# EAGLE schematic SipNPuff (EAGLE 9.7.0)
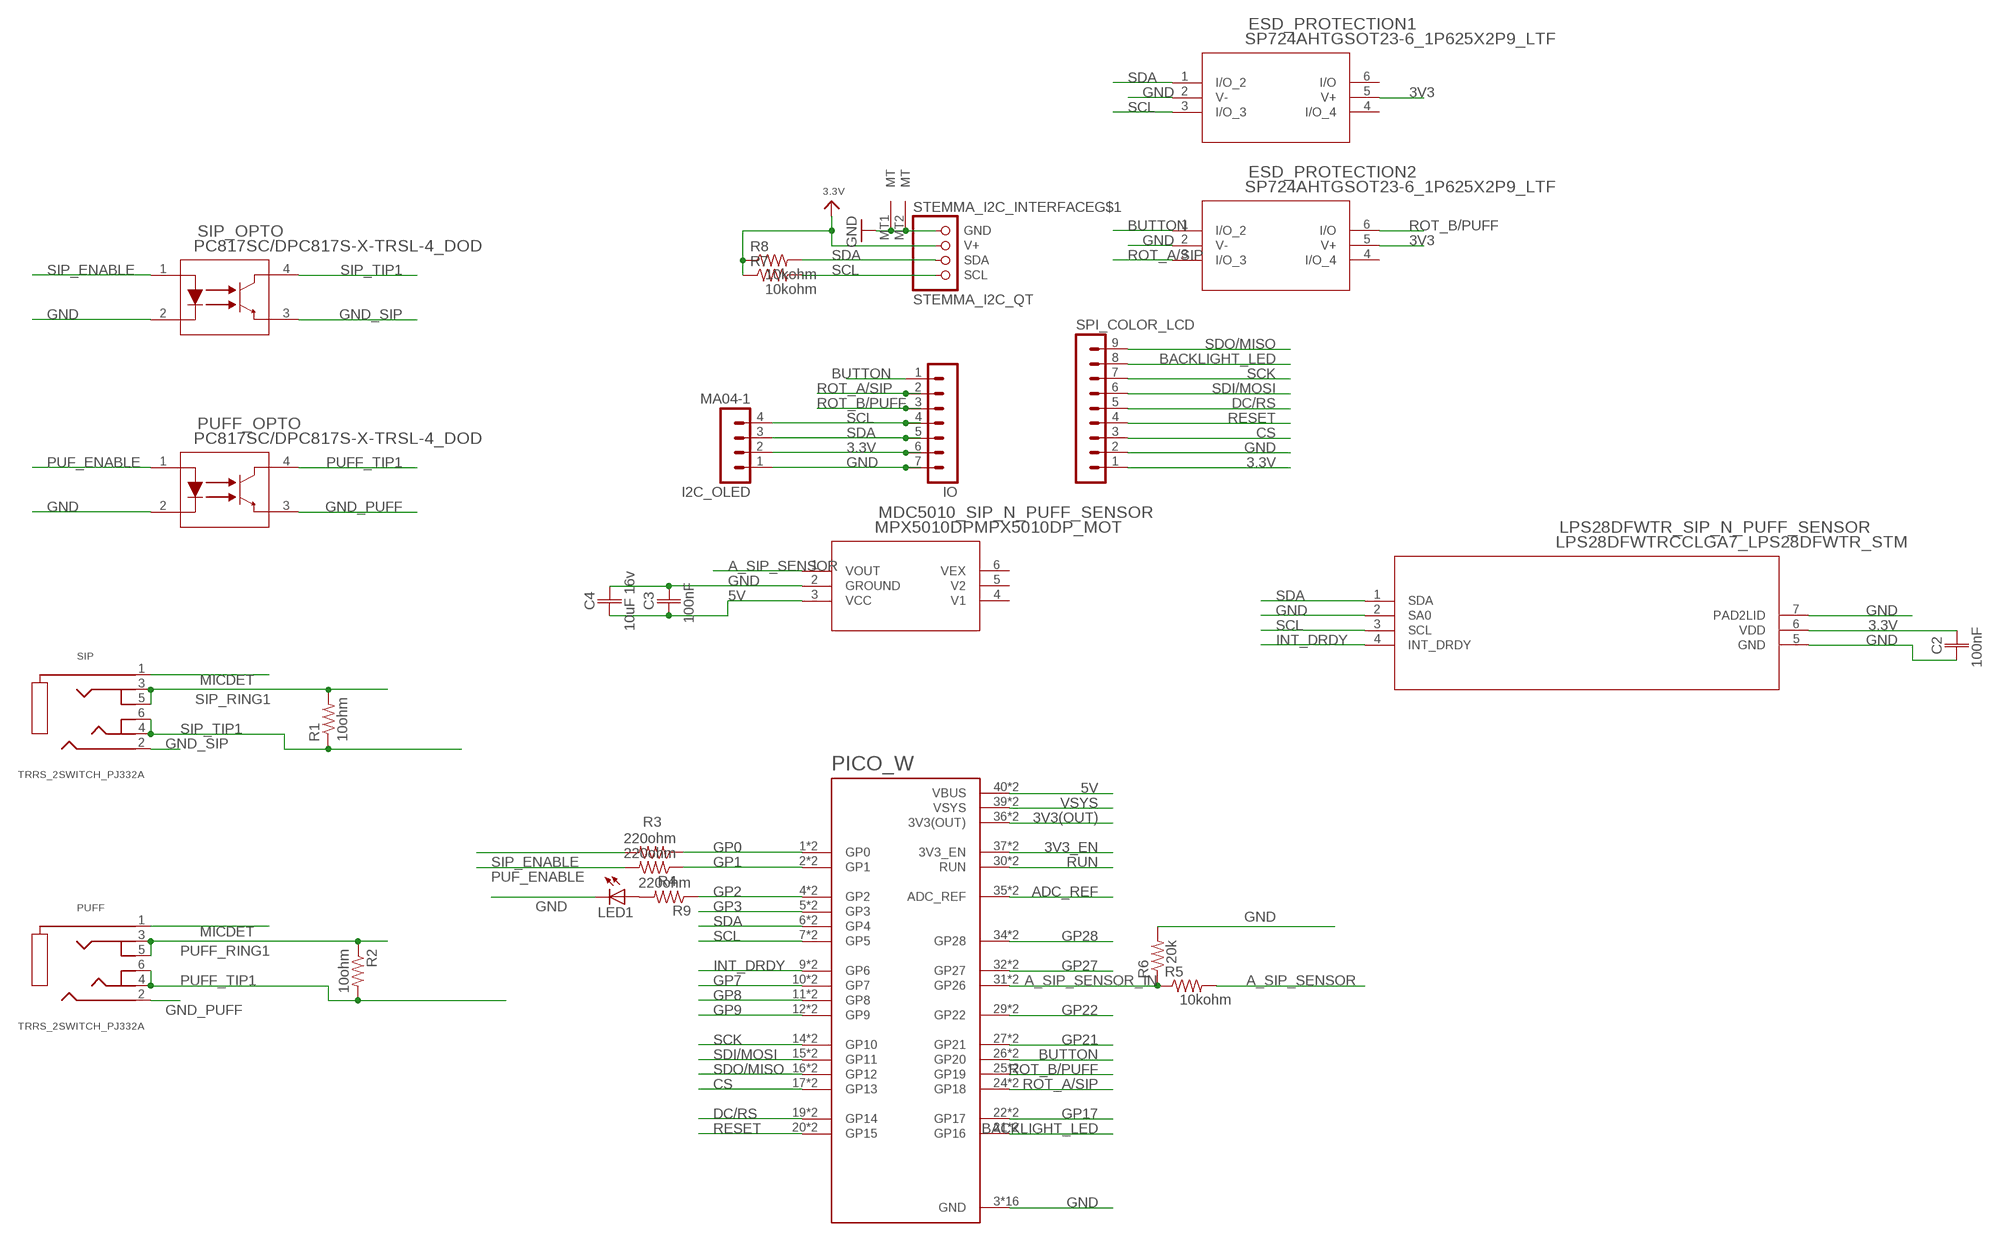
[diagram p0: schematic, sheet 1]

## Parts
C2  100nF  C_CHIP-0805(2012-METRIC)  [CAPC2012X110]
C3  100nF  C_CHIP-0805(2012-METRIC)  [CAPC2012X110]
C4  10uF 16v  C_CHIP-0805(2012-METRIC)  [CAPC2012X110]
ESD_PROTECTION1  SP724AHTGSOT23-6_1P625X2P9_LTF  [SOT23-6_1P625X2P9_LTF]
ESD_PROTECTION2  SP724AHTGSOT23-6_1P625X2P9_LTF  [SOT23-6_1P625X2P9_LTF]
I2C_OLED  MA04-1  [MA04-1]
IO  MA07-1  [MA07-1]
LED1  LEDCHIP-LED0805  [CHIP-LED0805]
LPS28DFWTR_SIP_N_PUFF_SENSOR  LPS28DFWTRCCLGA7_LPS28DFWTR_STM  [CCLGA7_LPS28DFWTR_STM]
MDC5010_SIP_N_PUFF_SENSOR  MPX5010DPMPX5010DP_MOT  [MPX5010DP_MOT]
PICO_W  RASPBERRY_PICO-NO_DEBUG  [PICO-PKG-NO_DEBUG]
PUFF  TRRS_2SWITCH_PJ332A  [PJ-332A]
PUFF_OPTO  PC817SC/DPC817S-X-TRSL-4_DOD  DPC817S-X-TRSL-4_DOD  [SL-4_DOD]
R1  10ohm  R-US_R0805  [R0805]
R2  10ohm  R-US_R0805  [R0805]
R3  220ohm  R-US_R0805  [R0805]
R4  220ohm  R-US_R0805  [R0805]
R5  10kohm  R-US_R0805  [R0805]
R6  20k  R-US_R0805  [R0805]
R7  10kohm  R-US_R0805  [R0805]
R8  10kohm  R-US_R0805  [R0805]
R9  220ohm  R-US_R0805  [R0805]
SIP  TRRS_2SWITCH_PJ332A  [PJ-332A]
SIP_OPTO  PC817SC/DPC817S-X-TRSL-4_DOD  DPC817S-X-TRSL-4_DOD  [SL-4_DOD]
SPI_COLOR_LCD  MA09-1  [MA09-1]
STEMMA_I2C_INTERFACE  STEMMA_I2C_QT  [JST_SH4]

## Nets
3.3V [Power]: C2.2 I2C_OLED.2(B) IO.6 LPS28DFWTR_SIP_N_PUFF_SENSOR.6(VDD) R7.1 R8.1 SPI_COLOR_LCD.1 STEMMA_I2C_INTERFACE.2(V+)
3V3 [power_2]: ESD_PROTECTION1.5(V+) ESD_PROTECTION2.5(V+)
3V3(OUT): PICO_W.36(3V3(OUT)) PICO_W.P$36(3V3(OUT))
3V3_EN: PICO_W.37(3V3_EN) PICO_W.P$37(3V3_EN)
5V: C3.1 C4.1 MDC5010_SIP_N_PUFF_SENSOR.3(VCC) PICO_W.40(VBUS) PICO_W.P$40(VBUS)
A_SIP_SENSOR: MDC5010_SIP_N_PUFF_SENSOR.1(VOUT) R5.2
A_SIP_SENSOR_IN: PICO_W.31(GP26) PICO_W.P$31(GP26) R5.1 R6.1
ADC_REF: PICO_W.35(ADC_REF) PICO_W.P$35(ADC_REF)
BACKLIGHT_LED: PICO_W.21(GP16) PICO_W.P$21(GP16) SPI_COLOR_LCD.8
BUTTON: ESD_PROTECTION2.1(I/O_2) IO.1 PICO_W.26(GP20) PICO_W.P$26(GP20)
CS: PICO_W.17(GP13) PICO_W.P$17(GP13) SPI_COLOR_LCD.3
DC/RS: PICO_W.19(GP14) PICO_W.P$19(GP14) SPI_COLOR_LCD.5
GND: C2.1 C3.2 C4.2 ESD_PROTECTION1.2(V-) ESD_PROTECTION2.2(V-) I2C_OLED.1(A) IO.7 LED1.C LPS28DFWTR_SIP_N_PUFF_SENSOR.2(SA0) LPS28DFWTR_SIP_N_PUFF_SENSOR.5(GND) LPS28DFWTR_SIP_N_PUFF_SENSOR.7(PAD2LID) MDC5010_SIP_N_PUFF_SENSOR.2(GROUND) PICO_W.3(GND) PICO_W.8(GND) PICO_W.13(GND) PICO_W.18(GND) PICO_W.23(GND) PICO_W.28(GND) PICO_W.33(GND) PICO_W.38(GND) PICO_W.P$3(GND) PICO_W.P$8(GND) PICO_W.P$13(GND) PICO_W.P$18(GND) PICO_W.P$23(GND) PICO_W.P$28(GND) PICO_W.P$33(GND) PICO_W.P$38(GND) PUFF_OPTO.2(CATHODE) R6.2 SIP_OPTO.2(CATHODE) SPI_COLOR_LCD.2 STEMMA_I2C_INTERFACE.1(GND) STEMMA_I2C_INTERFACE.MT1(MT) STEMMA_I2C_INTERFACE.MT2(MT)
GND_PUFF: PUFF.2(RING1) PUFF_OPTO.3(EMITTER)
GND_SIP: SIP.2(RING1) SIP_OPTO.3(EMITTER)
GP0: PICO_W.1(GP0) PICO_W.P$1(GP0) R3.1
GP1: PICO_W.2(GP1) PICO_W.P$2(GP1) R4.1
GP2: PICO_W.4(GP2) PICO_W.P$4(GP2) R9.1
GP3: PICO_W.5(GP3) PICO_W.P$5(GP3)
GP7: PICO_W.10(GP7) PICO_W.P$10(GP7)
GP8: PICO_W.11(GP8) PICO_W.P$11(GP8)
GP9: PICO_W.12(GP9) PICO_W.P$12(GP9)
GP17: PICO_W.22(GP17) PICO_W.P$22(GP17)
GP21: PICO_W.27(GP21) PICO_W.P$27(GP21)
GP22: PICO_W.29(GP22) PICO_W.P$29(GP22)
GP27: PICO_W.32(GP27) PICO_W.P$32(GP27)
GP28: PICO_W.34(GP28) PICO_W.P$34(GP28)
INT_DRDY: LPS28DFWTR_SIP_N_PUFF_SENSOR.4(INT_DRDY) PICO_W.9(GP6) PICO_W.P$9(GP6)
MICDET: PUFF.1(RING) SIP.1(RING)
N$1: LED1.A R9.2
PUF_ENABLE: PUFF_OPTO.1(ANODE) R4.2
PUFF_RING1: PUFF.3(RING2) PUFF.5(R2_SW) R2.1
PUFF_TIP1: PUFF.4(TIP) PUFF.6(TIP_SW) PUFF_OPTO.4(COLLECTOR) R2.2
RESET: PICO_W.20(GP15) PICO_W.P$20(GP15) SPI_COLOR_LCD.4
ROT_A/SIP: ESD_PROTECTION2.3(I/O_3) IO.2 PICO_W.24(GP18) PICO_W.P$24(GP18)
ROT_B/PUFF: ESD_PROTECTION2.6(I/O) IO.3 PICO_W.25(GP19) PICO_W.P$25(GP19)
RUN: PICO_W.30(RUN) PICO_W.P$30(RUN)
SCK: PICO_W.14(GP10) PICO_W.P$14(GP10) SPI_COLOR_LCD.7
SCL: ESD_PROTECTION1.3(I/O_3) I2C_OLED.4(D) IO.4 LPS28DFWTR_SIP_N_PUFF_SENSOR.3(SCL) PICO_W.7(GP5) PICO_W.P$7(GP5) R7.2 STEMMA_I2C_INTERFACE.4(SCL)
SDA: ESD_PROTECTION1.1(I/O_2) I2C_OLED.3(C) IO.5 LPS28DFWTR_SIP_N_PUFF_SENSOR.1(SDA) PICO_W.6(GP4) PICO_W.P$6(GP4) R8.2 STEMMA_I2C_INTERFACE.3(SDA)
SDI/MOSI: PICO_W.15(GP11) PICO_W.P$15(GP11) SPI_COLOR_LCD.6
SDO/MISO: PICO_W.16(GP12) PICO_W.P$16(GP12) SPI_COLOR_LCD.9
SIP_ENABLE: R3.2 SIP_OPTO.1(ANODE)
SIP_RING1: R1.2 SIP.3(RING2) SIP.5(R2_SW)
SIP_TIP1: R1.1 SIP.4(TIP) SIP.6(TIP_SW) SIP_OPTO.4(COLLECTOR)
VSYS: PICO_W.39(VSYS) PICO_W.P$39(VSYS)
Unconnected: ESD_PROTECTION1.4(I/O_4) ESD_PROTECTION1.6(I/O) ESD_PROTECTION2.4(I/O_4) MDC5010_SIP_N_PUFF_SENSOR.4(V1) MDC5010_SIP_N_PUFF_SENSOR.5(V2) MDC5010_SIP_N_PUFF_SENSOR.6(VEX)

## Library data of the parts
C2-C4 = Capacitor:C: Capacitor - Generic; CATEGORY: Capacitor; PACKAGE_SIZE: 0805; PACKAGE_TYPE: Surface Mount; SUBCATEGORY: Ceramic Capacitors; TYPE: MLCC
ESD_PROTECTION1 ESD_PROTECTION2 = 2022-12-15_20-19-59_Library:SP724AHTG; COPYRIGHT: Copyright (C) 2022 Ultra Librarian. All rights reserved.; DIGI-KEY_PART_NUMBER_1: F2863TR-ND; DIGI-KEY_PART_NUMBER_2: F2863CT-ND; DIGI-KEY_PART_NUMBER_3: F2863DKR-ND; MANUFACTURER_PART_NUMBER: SP724AHTG; MFR_NAME: Littelfuse Inc
I2C_OLED = SSIRacing:MA04-1
IO = con-lstb:MA07-1: PIN HEADER; OC_FARNELL: unknown; OC_NEWARK: unknown
LED1 = adafruit:LED: LED OSRAM: - CHIPLED LG R971, LG N971, LY N971, LG Q971, LY Q971, LO R971, LY R971 LH N974, LH R974 LS Q976, LO Q976, LY Q976 LO Q996 - Hyper CHIPLED LW Q18S LB Q993, LB Q99A, LB R99A - SideLED LS A670, LO A670, LY A670, LG A670, LP A670 LB A673, LV A673, LT A673, LW A673 LH A674 LY A675 LS A676, LA A676, LO A676, LY A676, LW A676 LS A679, LY A679, LG A679 - Hyper Micro SIDELED® LS Y876, LA Y876, LO Y876, LY Y876 LT Y87S - SmartLED LW L88C, LW L88S LB L89C, LB L89S, LG L890 LS L89K, LO L89K, LY L89K LS L896, LA L896, LO L896, LY L896 - TOPLED LS T670, LO T670, LY T670, LG T670, LP T670 LSG T670, LSP T670, LSY T670, LOP T670, LYG T670 LG T671, LOG T671, LSG T671 LB T673, LV T673, LT T673, LW T673 LH T674 LS T676, LA T676, LO T676, LY T676, LB T676, LH T676, LSB T676, LW T676 LB T67C, LV T67C, LT T67C, LS T67K, LO T67K, LY T67K, LW E67C LS E67B, LA E67B, LO E67B, LY E67B, LB E67C, LV E67C, LT E67C LW T67C LS T679, LY T679, LG T679 LS T770, LO T770, LY T770, LG T770, LP T770 LB T773, LV T773, LT T773, LW T773 LH T774 LS E675, LA E675, LY E675, LS T675 LS T776, LA T776, LO T776, LY T776, LB T776 LHGB T686 LT T68C, LB T68C - Hyper Mini TOPLED® LB M676 - Mini TOPLED Santana® LG M470 LS M47K, LO M47K, LY M47K Source: http://www.osram.convergy.de/
LPS28DFWTR_SIP_N_PUFF_SENSOR = LPS28D:LPS28DFWTR; COPYRIGHT: Copyright (C) 2026 Ultra Librarian. All rights reserved.; DATASHEET: https://www.st.com/resource/en/datasheet/lps28dfw.pdf; DESCRIPTION: Dual full-scale, 1260 hPa and 4060 hPa, absolute digital output barometer with water-resistant package; MANUFACTURER_NAME: STMicroelectronics; MANUFACTURER_PART_NUMBER: LPS28DFWTR
MDC5010_SIP_N_PUFF_SENSOR = MPX5010DP:MPX5010DP; COPYRIGHT: Copyright (C) 2026 Ultra Librarian. All rights reserved.; MANUFACTURER_NAME: Motorola; MANUFACTURER_PART_NUMBER: MPX5010DP
PICO_W = Pico_Library:RASPBERRY_PICO-NO_DEBUG
PUFF SIP = adafruit_electromech:TRRS_2SWITCH
PUFF_OPTO SIP_OPTO = DPC817S_X_TR:DPC817S-X-TR; COPYRIGHT: Copyright (C) 2026 Ultra Librarian. All rights reserved.; MANUFACTURER_NAME: Diodes Inc; MANUFACTURER_PART_NUMBER: DPC817S-X-TR
R1-R9 = PulseOximeterECG_AU:R-US_: RESISTOR, American symbol; SPICEPREFIX: R
SPI_COLOR_LCD = ModifidiedCon:MA09-1: PIN HEADER; OC_FARNELL: unknown; OC_NEWARK: unknown
STEMMA_I2C_INTERFACE = adafruit_electromech:STEMMA_I2C; LCSC: C2845363

## Net classes
1 power_2: width 0.305 mm
3 Power: width 0.305 mm, drill 0.483 mm